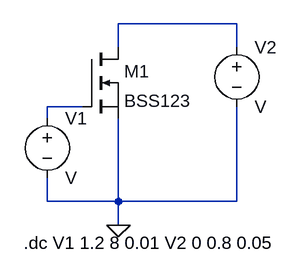
[diagram p0: schematic BSS123.asc]
BSS123.asc, the LTspice schematic file:
Version 4
SHEET 1 1496 740
WIRE 352 80 192 80
WIRE 192 112 192 80
WIRE 352 112 352 80
WIRE 144 192 96 192
WIRE 96 208 96 192
WIRE 96 320 96 288
WIRE 192 320 192 208
WIRE 192 320 96 320
WIRE 352 320 352 192
WIRE 352 320 192 320
WIRE 192 352 192 320
FLAG 192 352 0
SYMBOL nmos 144 112 R0
SYMATTR InstName M1
SYMATTR Value BSS123
SYMBOL voltage 96 192 R0
SYMATTR InstName V1
SYMBOL voltage 352 96 R0
SYMATTR InstName V2
TEXT 64 376 Left 2 !.dc V1 1.2 8 0.01 V2 0 0.8 0.05

The netlist it stands for:
* BSS123.asc
M1 N001 N002 0 0 BSS123
V1 N002 0 V
V2 N001 0 V
.model NMOS NMOS
.model PMOS PMOS
.lib standard.mos
.dc V1 1.2 8 0.01 V2 0 0.8 0.05
.backanno
.end